# EAGLE design Gemma M0 rev D PyCon (EAGLE 6.4)
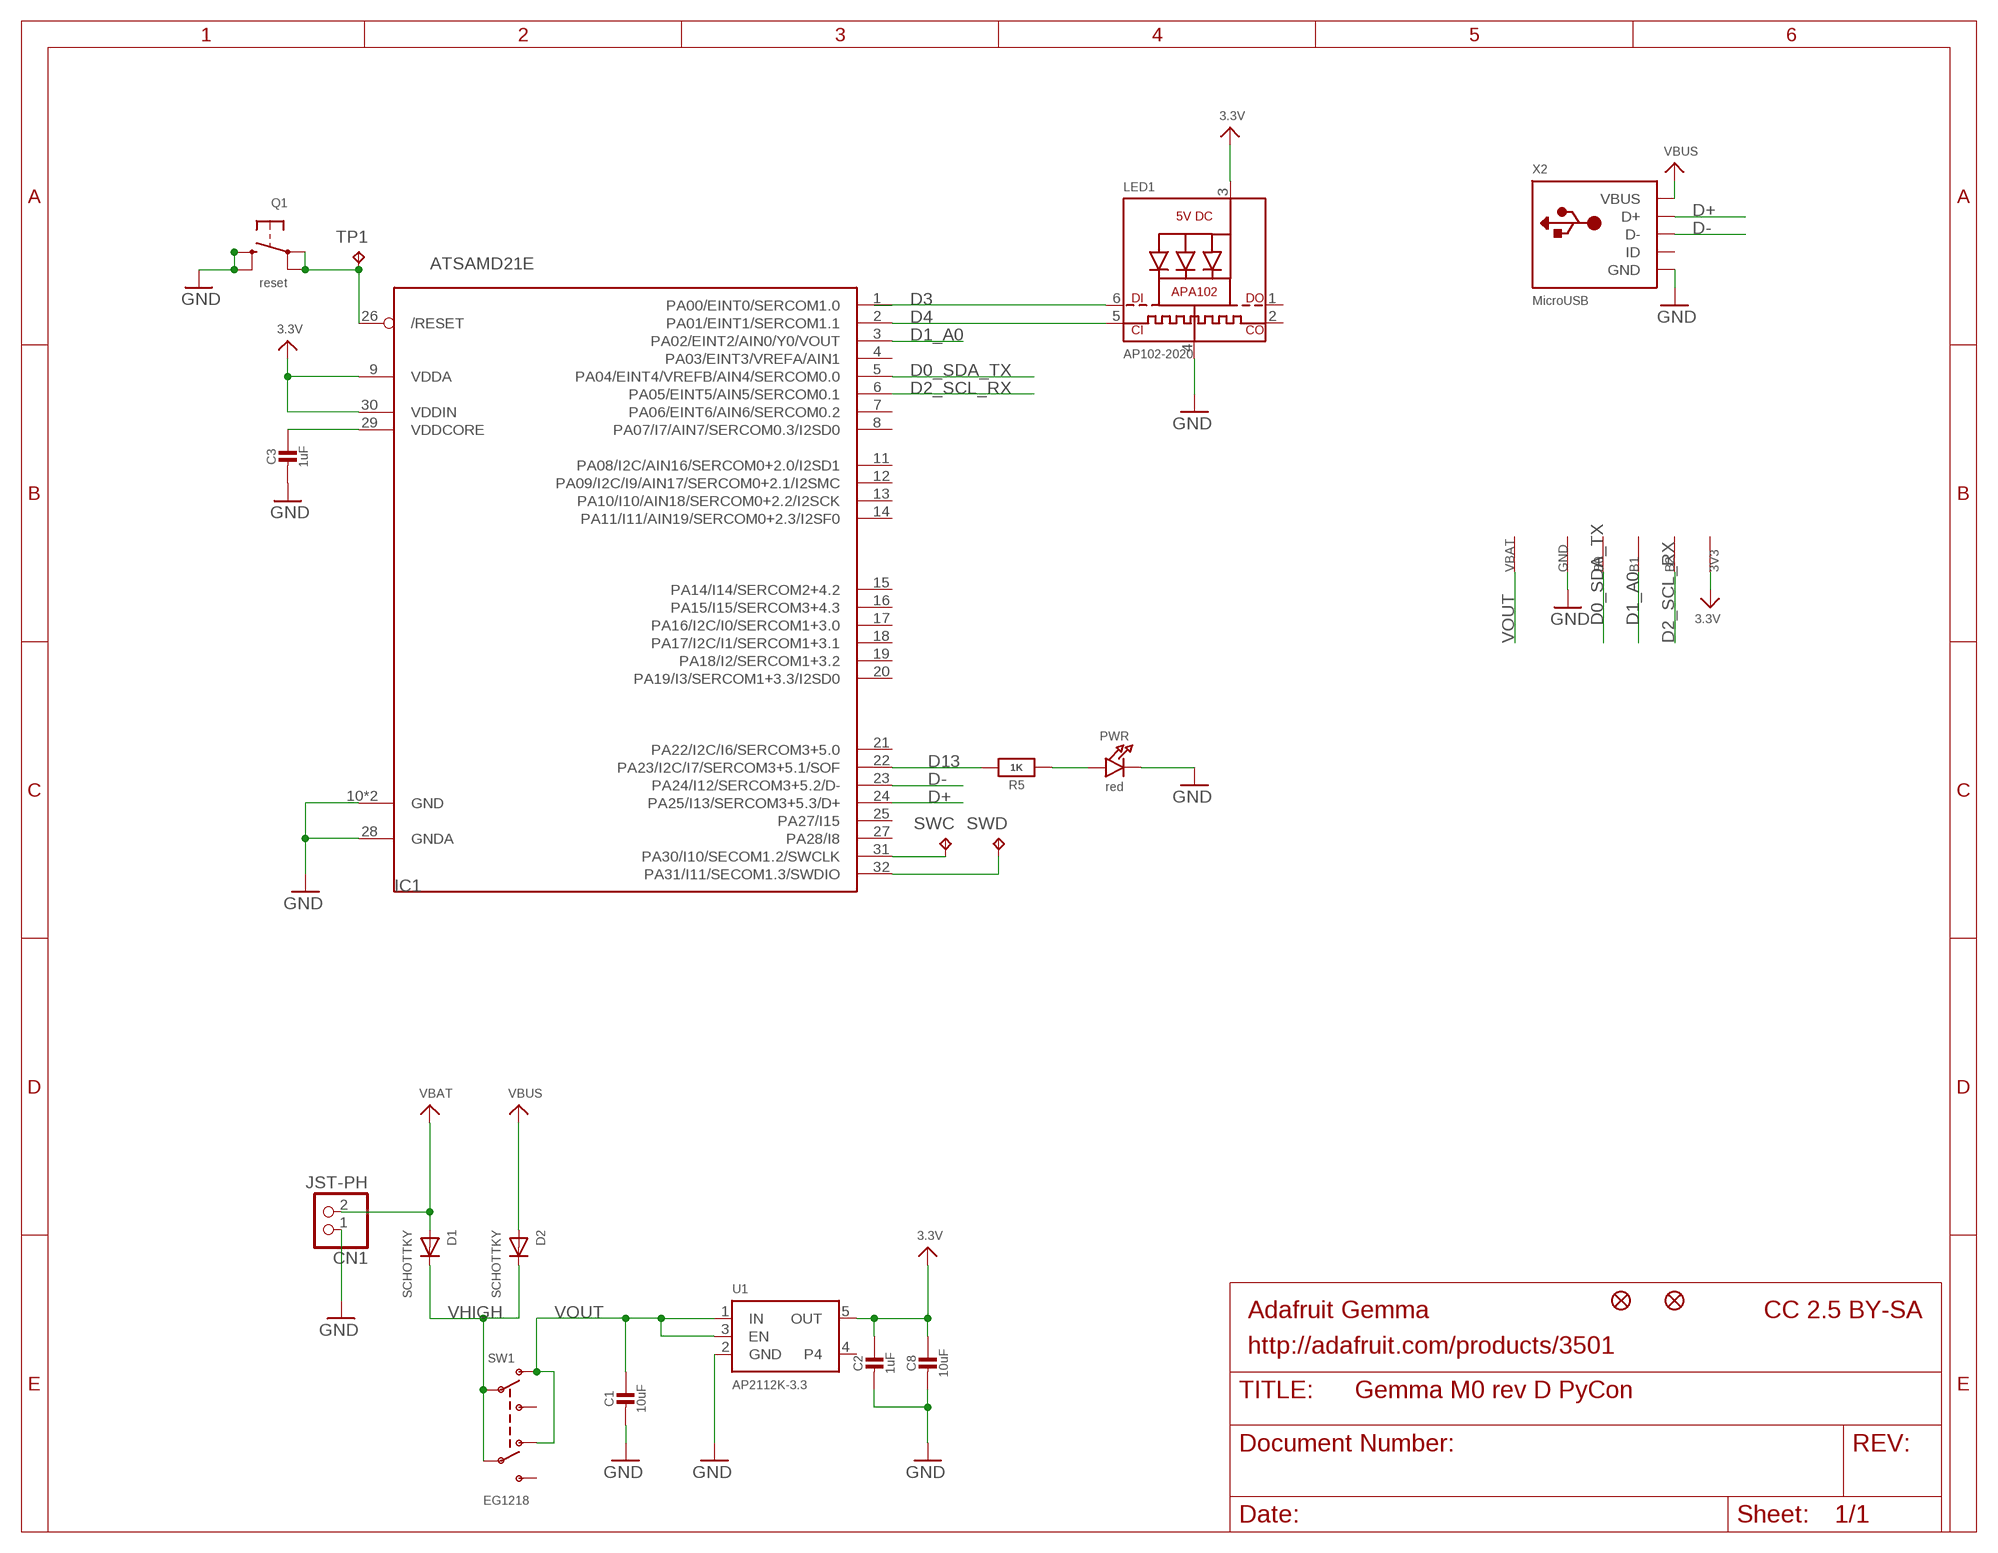
[diagram p0: schematic, sheet 1]

## Parts
3V3  SEWTAP-ALLIGATOR  [SEWALLI]
B0  SEWTAP-ALLIGATOR  [SEWALLI]
B1  SEWTAP-ALLIGATOR  [SEWALLI]
B2  SEWTAP-ALLIGATOR  [SEWALLI]
C1  10uF  CAP_CERAMIC0805-NOOUTLINE  [0805-NO]
C2  1uF  CAP_CERAMIC0603_NO  [0603-NO]
C3  1uF  CAP_CERAMIC0603_NO  [0603-NO]
C8  10uF  CAP_CERAMIC0805-NOOUTLINE  [0805-NO]
CN1  JST-PH  CON_JST_PH_2PIN  [JSTPH2]
D1  SCHOTTKY  DIODE_SOD-123FL  [SOD-123FL]
D2  SCHOTTKY  DIODE_SOD-123FL  [SOD-123FL]
GND  SEWTAP-ALLIGATOR  [SEWALLI]
IC1  ATSAMD21E  [QFN32_5MM]
LED1  AP102-2020  APA1022020  [APA102_2020]
PWR  red  LED0603_NOOUTLINE  [CHIPLED_0603_NOOUTLINE]
Q1  reset  SWITCH_TACT_SMT4.6X2.8  [BTN_KMR2_4.6X2.8]
R5  1K  RESISTOR_0603_NOOUT  [0603-NO]
SW1  EG1218  SWITCH_DPDTEG1390  [EG1390]
SWC  TPTP15R  [TP15R]
SWD  TPTP15R  [TP15R]
TP1  TPTP16R  [TP16R]
U1  AP2112K-3.3  VREG_SOT23-5  [SOT23-5]
U$1  FIDUCIAL_1MM  [FIDUCIAL_1MM]
U$6  FIDUCIAL_1MM  [FIDUCIAL_1MM]
VBAT  SEWTAP-ALLIGATOR  [SEWALLI]
X2  MicroUSB  USB_MICRO_20329_V2  [4UCONN_20329_V2]

## Nets
3.3V: 3V3.P$1(SEW) C2.1 C8.1 IC1.9(VDDA) IC1.30(VDDIN) LED1.3(VDD) U1.5(OUT)
!RESET: IC1.26(/RESET) Q1.A'(P1) Q1.A(P) TP1.TP
D0_SDA_TX: B0.P$1(SEW) IC1.5(PA04/EINT4/VREFB/AIN4/SERCOM0.0)
D1_A0: B1.P$1(SEW) IC1.3(PA02/EINT2/AIN0/Y0/VOUT)
D2_SCL_RX: B2.P$1(SEW) IC1.6(PA05/EINT5/AIN5/SERCOM0.1)
D3: IC1.1(PA00/EINT0/SERCOM1.0) LED1.6(DI)
D4: IC1.2(PA01/EINT1/SERCOM1.1) LED1.5(CKI)
D13: IC1.22(PA23/I2C/I7/SERCOM3+5.1/SOF) R5.2
D+: IC1.24(PA25/I13/SERCOM3+5.3/D+) X2.D+
D-: IC1.23(PA24/I12/SERCOM3+5.2/D-) X2.D-
GND: C1.2 C2.2 C3.2 C8.2 CN1.1 GND.P$1(SEW) IC1.10(GND) IC1.28(GNDA) IC1.33(GND) LED1.4(GND) PWR.C Q1.B'(S1) Q1.B(S) U1.2(GND) X2.BASE@1(GND) X2.BASE@2(GND) X2.GND X2.SPRT@1(GND) X2.SPRT@2(GND) X2.SPRT@3(GND) X2.SPRT@4(GND)
N$1: PWR.A R5.1
SWCLK: IC1.31(PA30/I10/SECOM1.2/SWCLK) SWC.TP
SWDIO: IC1.32(PA31/I11/SECOM1.3/SWDIO) SWD.TP
VBAT: CN1.2 D1.A
VBUS: D2.A X2.VBUS
VDDCORE: C3.1 IC1.29(VDDCORE)
VHIGH: D1.C D2.C SW1.P1 SW1.P2
VOUT: C1.1 SW1.O1 SW1.O2 U1.1(IN) U1.3(EN) VBAT.P$1(SEW)
Unconnected: IC1.4(PA03/EINT3/VREFA/AIN1) IC1.7(PA06/EINT6/AIN6/SERCOM0.2) IC1.8(PA07/I7/AIN7/SERCOM0.3/I2SD0) IC1.11(PA08/I2C/AIN16/SERCOM0+2.0/I2SD1) IC1.12(PA09/I2C/I9/AIN17/SERCOM0+2.1/I2SMC) IC1.13(PA10/I10/AIN18/SERCOM0+2.2/I2SCK) IC1.14(PA11/I11/AIN19/SERCOM0+2.3/I2SF0) IC1.15(PA14/I14/SERCOM2+4.2) IC1.16(PA15/I15/SERCOM3+4.3) IC1.17(PA16/I2C/I0/SERCOM1+3.0) IC1.18(PA17/I2C/I1/SERCOM1+3.1) IC1.19(PA18/I2/SERCOM1+3.2) IC1.20(PA19/I3/SERCOM1+3.3/I2SD0) IC1.21(PA22/I2C/I6/SERCOM3+5.0) IC1.25(PA27/I15) IC1.27(PA28/I8) LED1.1(DO) LED1.2(CKO) SW1.S1 SW1.S2 U1.4 X2.ID

## Notes on the sheet
- Adafruit Gemma | CC 2.5 BY-SA
- http://adafruit.com/products/3501

## Library data of the parts
3V3 B0 B1 B2 GND VBAT = microbuilder:SEWTAP
C1-C3 C8 = microbuilder:CAP_CERAMIC: Ceramic Capacitors For new designs, use the packages preceded by an '_' character since they are more reliable: The following footprints should be used on most boards: _0402 - Standard footprint for regular board layouts _0603 - Standard footprint for regular board layouts _0805 - Standard footprint for regular board layouts _1206 - Standard footprint for regular board layouts For extremely tight-pitch boards where space is at a premium, the following 'micro-pitch' footprints can be used (smaller pads, no silkscreen outline, etc.): _0402MP - Micro-pitch footprint for very dense/compact boards _0603MP - Micro-pitch footprint for very dense/compact boards _0805MP - Micro-pitch footprint for very dense/compact boards _1206MP - Micro-pitch footprint for very dense/compact boards
CN1 = microbuilder:CON_JST_PH_2PIN: JST 2-Pin Right-Angle Connector PH-Series - 4UConnector: 17311 SH-Series - 4UConnector: 07278
D1 D2 = adafruit:DIODE: Diode SMADIODE - SMA Surface Mount Package 20V 1A Schottky Diode Digikey: 641-1014-6-ND DO-1N4148 - Through Hole Small Current Diode SOD-123 20V 1 A (.5mV Vf) Schottky Diode - Digikey: MBRX120TPMSCT-ND SOD-323 10V 570mA (.38mV Vf, 3ns) Schottky Diode - Digikey: ZLLS410CT-ND SOD-523 30V 30mA Schottky Diode (RB751S-40TE61) - Digikey: RB751S-40TE61CT-ND SOT23-R/W - SOT23 Package (R = Solder Paste/Reflow Ovens, W = Hand-Soldering) BAT54Film 40V 300mA - Digikey: 497-7162-1-ND
IC1 = microbuilder:ATSAMD21E
LED1 = microbuilder:APA102: APA102/DotStar Pixels VCC: 5V DC Refresh Rate: 400Hz
PWR = microbuilder:LED: LED 0603 - 0603 Surface Mount Package 2mA: Green LED - Low Power (3.9mcd, 2ma, 1.7Vf) - Digikey: 475-2709-2-ND Orange LED - Low Power (9.8mcd, 2ma, 1.8Vf) - Digikey: 475-1194-2-ND Red LED - Low Power (5mcd, 2ma, 1.8Vf) - Digikey: 475-1195-2-ND Yellow LED - Low Power (7mcd, 2ma, 1.8Vf) - Digikey: 475-1196-2-ND 5mA: Blue LED - Low Power (17mcd, 5ma, 2.9Vf) - Digikey: LNJ937W8CRACT-ND 0805 - 0805 Surface Mount Package 2mA: Red LED (8.8mcd, 2mA, 1.8Vf, Clear) - Low Power [Digikey: 475-2510-1-ND] Green LED (5mcd, 2mA, 1.8Vf, Clear) - Low Power [Digikey: 475-2730-1-ND] Yellow LED (11.3mcd, 2mA, 1.8Vf, Clear) - Low Power [Digikey: 475-2555-1-ND] 20mA: Red LED (104mcd, 20mA, Diffused) - LS R976 [Digikey: 475-1278-6-ND] Red LED (12mcd, 20mA, 2.0Vf, Clear) - APT2012EC [Digikey: 754-1128-1-ND] Green LED (15mcd, 20mA, 2.2Vf, Clear) - APT2012GC [Digikey: 754-1131-1-ND] Orange LED (160mcd, 20mA, 2.1Vf, Clear) - APT2012SECK [Digikey: 754-1130-1-ND] 1206 - 1206 Surface Mount Package Green LED (26mcd, 20mA, Diffused) - LG N971 [Digikey: 475-1407-6-ND] Red LED (15mcd, 20mA, Diffused) - LH N974 [Digikey: 475-1416-6-ND] Cree - Cree High-Power Surface Mount LEDs XPEBWT-L1-0000-00D50 - White 111lm 350mA 2.9Vf 6200K 110° XTEAWT-00-0000-00000LEE3 - White 114lm 350mA 2.85Vf 5000K 115° Everlight - Everlight 45-21 Series Surface Mount LEDs 45-21/QK2C-B2832AC2CB2/2T - Warm White 2000mcd 20mA 3.25Vf 3050K 120° 45-21/LK2C-B38452C4CB2/2T - Nuetral White 2000mcd 20mA 3.25Vf 4150K 120° 45-21/LK2C-B50634C6CB2/2T - Cold White 2200mcd 20mA 3.25Vf 5650K 120° PLCC2 Reverse Mount LS T77K-J1L2-1-0-2-R18-Z - Red 11.25mcd 2mA 1.8Vf 630nm 120° LO T77K-L1M2-24-Z - Orange 19.6mcd 2mA 1.8Vf 606nm 120° LY T77K-K2M1-26-Z - Yellow 15.7mcd 2mA 1.8Vf 587nm 120°
Q1 = microbuilder:SWITCH_TACT_SMT: SMT Tact Switches 6x6mm - Digikey: P12940SCT-ND KMR2 (4.6x2.8mm) - Digikey: 401-1426-1-ND EVQ-PQHB55 - Light Touch, 160GF (4.5x4.5mm) - Digikey: P8090SCT-ND KMT0 - KMT021 NGJ LHS (etc.) IP68/Waterproof - Digikey: CKN10289CT-ND
R5 = microbuilder:RESISTOR: Resistors For new designs, use the packages preceded by an '_' character since they are more reliable: The following footprints should be used on most boards: _0402 - Standard footprint for regular board layouts _0603 - Standard footprint for regular board layouts _0805 - Standard footprint for regular board layouts _1206 - Standard footprint for regular board layouts For extremely tight-pitch boards where space is at a premium, the following 'micro-pitch' footprints can be used (smaller pads, no silkscreen outline, etc.): _0402MP - Micro-pitch footprint for very dense/compact boards _0603MP - Micro-pitch footprint for very dense/compact boards _0805MP - Micro-pitch footprint for very dense/compact boards _1206MP - Micro-pitch footprint for very dense/compact boards
SW1 = microbuilder:SWITCH_DPDT: Switch - DPDT A DPDT Switch acts like an SPDT switch, but has a pair of switches instead of just one. Vertical - 0.3A @ 6V SMT - Digikey: JS202011SCQN
SWC SWD TP1 = testpad:TP: Test pad
U1 = microbuilder:VREG_SOT23-5: SOT23-5 Fixed Voltage Regulators Part Current Out V Out V In V Dropout θJA (°C/W) TJ (°C) Digikey Part No. ADP121 150mA 3.3V 3.4-5.5V 0.09V @ 150mA -- -- ADP121-AUJZ33R7CT-ND ADP121 150mA 3.0V 3.1-5.5V 0.09V @ 150mA -- -- ADP121-AUJZ30R7CT-ND ADP122 300mA 3.3V 3.4-5.5V 0.085V @ 300mA -- -- ADP122AUJZ-3.3-R7CT-ND ADP1712 300mA 3.3V 3.5-5.5V 0.17V @ 300mA -- -- ADP1712AUJZ-3.3-R7TR-ND AP7311 (Low Cost) 150mA 3.3V 3.5-6V 0.15V @ 150mA -- -- AP7311-33WG-7DICT-ND LD39015M18R 150mA 1.8V 1.9V-5.5V 0.08V @ 100mA -- -- 497-6977-1-ND LP2985A-33DBVR 150mA 3.3V 3.3-16V 0.28V @ 150mA 206 150 296-18479-1-ND MCP1824T-3302E/OT 300mA 3.3V 3.5V-6V 0.2V @ 300mA -- -- MCP1824T-3302E/OTCT-ND MIC5205-2.5YM5 TR 150mA 2.5V 2.7-16V 0.165V @ 150mA -- -- 576-1257-2-ND MIC5205-3.0YM5 TR 150mA 3.0V 3.2V-16V 0.165V @ 150mA -- -- 576-1258-2-ND MIC5205-3.3YM5 TR 150mA 3.3V 3.5V-16V 0.165V @ 150mA -- -- 576-1259-2-ND TPS780330220 150mA 3.3V+2.2V 3.6-5.5V 250mV Max -- -- 296-23332-1-ND TDA3663/N1,135 100mA 3.3V 3.5-45V 0.18V @ 50mA -- -- 568-5343-1-ND Max operating temp can be calculated using θJA, TJ (max junction temperature), and power in watts. Set the "Maximum Ambient Temperature" until it reaches TJ ("Max Junction Temperature"), which is the absolute limit for safe use of the regulator: Heat Sink Temperature Calculator <http://www.daycounter.com/Calculators/Heat-Sink-Temperature-Calculator.phtml> For example, With 12V source into a 3.3V LP2985 and a 30mA load, we are dissipating (12V-3.3V) * 0.03A = 0.261W. With a θJA of 206 °C/W, a TJ of 150°C, and 261mW we can safely use the chip without a heat sink up to 75°C (=147.1°C Junction Temperature).
U$1 U$6 = microbuilder:FIDUCIAL: Fiducial Alignment Points Various fiducial points for machine vision alignment.; BOM: EXCLUDE
X2 = microbuilder:USB: USB Connectors USBMINIB - Surface Mount Female Mini-B USB Connector 4UConnector: 06564

## Board
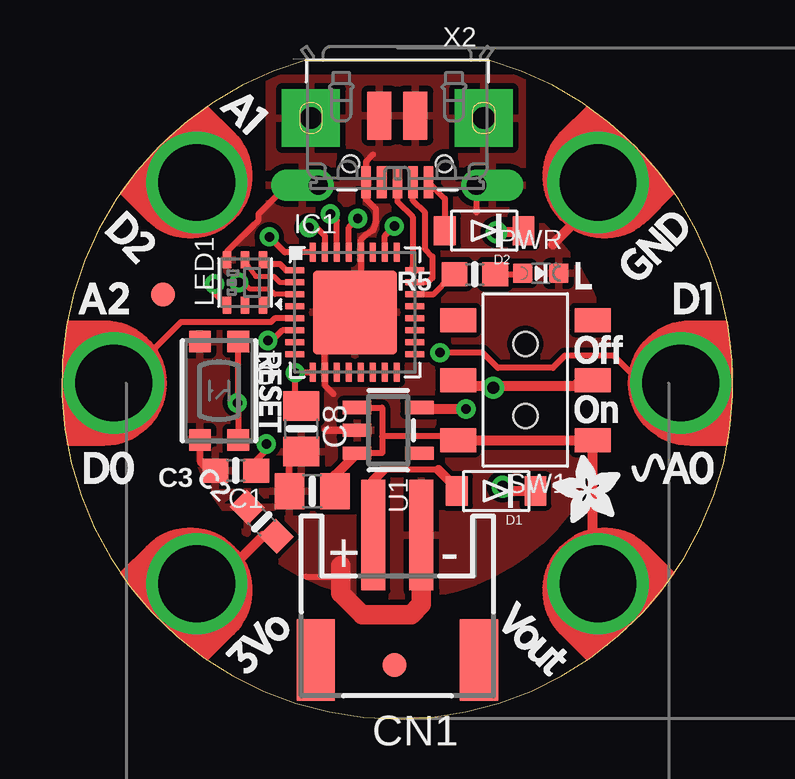
[diagram p1: board, top side]
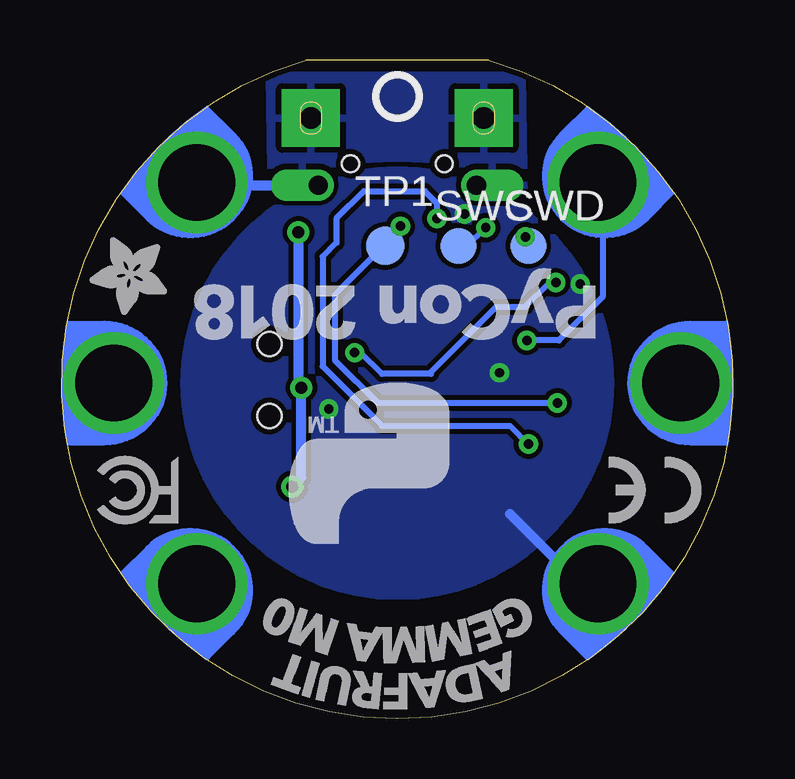
[diagram p2: board, bottom side, seen from below]

Size 27.97 x 27.46 mm. Coordinates in mm from the lower left corner, seen from the top.
Outline: 10.17,27.46 17.79,27.46 arc-328 10.17,27.46
Copper layers (1*16): Top 0.035mm / dielectric 1.5mm / Bottom 0.035mm
Design rules "adafruit *": minimum track width 8mil, minimum drill 15.5mil, track to track 8mil, track to pad 8mil, pad to pad 8mil, via to via 8mil, smd to smd 8mil, copper to edge 10mil, drill to drill 8mil, minimum pad ring 10mil, minimum via ring 8mil, stop-mask expansion 2mil, vias tented up to drill 20mil, thermal gap 10mil

### Footprints (pad centres in the part's own frame; a part is rotated, then mirrored left to right if it is on the bottom)
SEWALLI = drill 3.2: P$1 0,0.508
0805-NO = smd 1.24 x 1.5: 1 -0.95,0; 2 0.95,0
0603-NO = smd 1.075 x 1: 1 -0.85,0; 2 0.85,0
JSTPH2 = smd 1 x 4.6: 1 -1,-3.7; 2 1,-3.7 | smd 1.6 x 3.4: NC1 -3.4,1.5; NC2 3.4,1.5
SOD-123FL = smd 0.91 x 1.22: A 1.637,0; C -1.637,0
QFN32_5MM = smd 0.8 x 0.25: 1 -2.5,1.75; 2 -2.5,1.25; 3 -2.5,0.75; 4 -2.5,0.25; 5 -2.5,-0.25; 6 -2.5,-0.75; 7 -2.5,-1.25; 8 -2.5,-1.75; 17 2.5,-1.75; 18 2.5,-1.25; 19 2.5,-0.75; 20 2.5,-0.25; 21 2.5,0.25; 22 2.5,0.75; 23 2.5,1.25; 24 2.5,1.75 | smd 0.25 x 0.8: 9 -1.75,-2.5; 10 -1.25,-2.5; 11 -0.75,-2.5; 12 -0.25,-2.5; 13 0.25,-2.5; 14 0.75,-2.5; 15 1.25,-2.5; 16 1.75,-2.5; 25 1.75,2.5; 26 1.25,2.5; 27 0.75,2.5; 28 0.25,2.5; 29 -0.25,2.5; 30 -0.75,2.5; 31 -1.25,2.5; 32 -1.75,2.5 | smd 3.5 x 3.5: 33 0,0
APA102_2020 = smd 0.7 x 0.35: 1 -0.95,-0.75; 2 -0.95,0; 3 -0.95,0.75; 4 0.95,0.75; 5 0.95,0; 6 0.95,-0.75
CHIPLED_0603_NOOUTLINE = smd 0.8 x 0.8: A 0,-0.75; C 0,0.75
BTN_KMR2_4.6X2.8 = smd 0.9 x 0.9: A 2.05,0.8; A' -2.05,0.8; B 2.05,-0.8; B' -2.05,-0.8
EG1390 = smd 1 x 1.5: O1 -2.5,2.8; O2 -2.5,-2.8; P1 0,2.8; P2 0,-2.8; S1 2.5,2.8; S2 2.5,-2.8 | hole 1: 1.5,0; -1.5,0
TP15R = smd 1.5 x 1.5: TP 0,0
TP16R = smd 1.6 x 1.6: TP 0,0
SOT23-5 = smd 0.55 x 1.2: 1 -0.95,-1.3; 2 0,-1.3; 3 0.95,-1.3; 4 0.95,1.3; 5 -0.95,1.3
FIDUCIAL_1MM = smd 1 x 1: 1 0,0
4UCONN_20329_V2 = smd 1 x 2: BASE@1 -0.75,-2; BASE@2 0.75,-2 | smd 0.4 x 1.35: D+ 0,0.775; D- -0.65,0.775; GND 1.3,0.775; ID 0.65,0.775; VBUS -1.3,0.775 | drill 0.8 pad 1.143 offset: SPRT@1 -3.3,0.9; SPRT@2 3.3,0.9 | drill 0.9 pad 2.413 square: SPRT@3 -3.6,-1.9; SPRT@4 3.6,-1.9 | hole 0.7: -1.95,0; 1.95,0

### Placement (x,y rotation side)
3V3  5.98,5.99 135 top
B0  2.68,14 90 top
B1  25.29,14 270 top
B2  5.98,22 45 top
C1  10.44,9.49 180 top
C2  8.33,8.22 135 top
C3  7.26,10.35 180 top
C8  9.98,12.09 270 top
CN1  13.98,3.96 180 top
D1  18.1,9.5 180 top
D2  17.6,20.35 180 top
GND  21.99,22 315 top
IC1  12.21,16.94 0 top
LED1  7.63,18.19 90 top
PWR  19.95,18.57 270 top
Q1  6.55,13.68 270 top
R5  17.21,18.53 180 top
SW1  19.32,14.12 90 top
SWC  11.44,19.71 0 bottom
SWD  8.52,19.71 0 bottom
TP1  14.49,19.71 0 bottom
U1  13.6,12.03 270 top
U$1  4.22,17.68 90 top
U$2  [GEMMA_M0_PYCON_BOTTOM]  0.01,27.33 180 bottom
U$6  13.86,2.24 0 top
U$8  [GEMMA_M0_TOP]  0.01,0.03 0 top
U$10  [PCBFEAT-REV-040]  13.98,25.93 0 bottom
VBAT  21.99,5.99 225 top
X2  13.98,23.14 180 top

### Tracks (layer width: path | path; a pad name or v marks a point on that pad's centre or on a via)
3.3V  (via drill 0.39)
  Top 0.254: IC1.30 11.46,20.77 v11.19,21.04 | IC1.9 10.45,14.43 v9.73,14.43 | LED1.3 6.36,17.76 v6.36,18.12 | 9.79,14.36 v9.73,14.43 | C8.1 9.73,13.29 v9.73,14.43
  Top 0.406: C2.1 8.37,7.62 6.39,5.64 3V3.P$1 | U1.5 14.96,12.92 v16.84,12.92
  Bottom 0.254: 3V3.P$1 6.39,5.64
  Bottom 0.406: 6.39,5.64 9.29,8.53
  pour Bottom: 5.09,14 arc90 13.98,5.11 arc90 22.87,14 arc90 13.98,22.89 arc90
!RESET  (via drill 0.39)
  Top 0.254: IC1.26 13.46,20.14 v13.86,20.54 | 7.35,15.56 Q1.A' 7.35,13.21 v7.32,13.17 7.35,13.13 Q1.A
  Bottom 0.254: 14.49,19.77 14.43,19.84 14.43,19.96 v13.86,20.54 | 14.49,19.77 16.59,17.68 16.59,14.95 14.81,13.17 v7.32,13.17 | TP1.TP 14.49,19.77
D0_SDA_TX
  Top 0.254: IC1.5 8.87,16.69 8.71,16.54 4.97,16.54 2.43,14 B0.P$1
D1_A0  (via drill 0.39)
  Top 0.203: IC1.3 8.89,17.69 8.65,17.93 7.82,17.93 7.57,18.19 v7.38,18.19
  Top 0.254: B1.P$1 24.14,14 23,15.14 20.97,15.14 20.46,14.63 18.18,14.63 17.54,15.27 v15.76,15.27
  Bottom 0.254: v15.76,15.27 15.51,15.27 14.62,14.38 12.59,14.38 12.59,14.44 9.86,17.17 8.65,17.17 7.63,18.19 v7.38,18.19
D2_SCL_RX  (via drill 0.39)
  Top 0.254: IC1.6 9.2,16.19 8.78,15.77 v8.59,15.77
  Bottom 0.254: 5.6,22.33 B2.P$1 | 5.67,22.31 B2.P$1 | v8.59,15.77 7.25,15.77 5.41,17.61 5.41,20.22 5.62,20.43 B2.P$1
D3
  Top 0.203: 9.67,18.69 IC1.1
  Top 0.254: 9.67,18.69 9.35,18.69 9.1,18.95 8.57,18.95 LED1.6
D4
  Top 0.203: IC1.2 9.09,18.19 8.84,18.44 8.08,18.44 7.76,18.88 7.63,19.01 LED1.5
D13
  Top 0.254: IC1.22 15.47,17.69 16.22,18.44 16.27,18.44 R5.2
D+
  Top 0.254: X2.D+ 13.98,21.55 14.62,20.92 14.62,18.85 14.71,18.76 IC1.24
D-
  Top 0.254: IC1.23 15.26,18.19 15.44,18.38 15.44,19.27 15.13,19.58 15.13,21.11 14.63,21.6 X2.D-
GND
  Top 0.254: 17.28,21.09 X2.SPRT@1 17.4,22.36 | 10.68,22.12 X2.SPRT@2 9.4,22.24 8.21,21.04 8.21,20.79 6.88,19.47 LED1.4 | 12.21,17.01 10.96,15.76 IC1.10 10.96,13.91 11.32,13.55 | 10.17,5.93 11.64,5.93 | Q1.B 5.76,10.7 6.1,10.35 C3.2 | 12.97,23.52 12.68,23.24 X2.GND 12.68,21.65 13.1,21.23 13.1,20.79 12.97,20.35 12.65,20.16 12.46,19.97 IC1.28 12.46,17.26 12.21,17.01 | 12.21,17.01 IC1.33 | C1.2 9.49,10.9 9.73,11.14 C8.2
  Top 0.305: 11,12.03 U1.2
  Top 0.406: 20.46,19.77 22.34,21.66 GND.P$1
  Top 0.813: CN1.1 14.98,4.77 14.56,4.34 12.52,4.34 11.64,5.23 11.64,5.93 11.64,6.38
  Bottom 0.406: 22.34,22.01 22.11,22.24 | 22.11,22.24 X2.SPRT@1 | GND.P$1 22.23,22.24 22.11,22.24
  pour Bottom (rank 2): 8.78,26.82 8.65,18.95 19.19,18.95 19.32,26.82
  pour Top: 5.09,14 arc90 13.98,5.11 arc90 22.87,14 arc90 13.98,22.89 arc90
  pour Top: 8.65,26.7 8.65,18.95 19.19,18.95 19.19,26.7
N$1
  Top 0.254: R5.1 19.17,18.53 PWR.A
SWCLK  (via drill 0.39)
  Top 0.254: IC1.31 10.96,20.13 10.62,20.47 v10.3,20.47
  Bottom 0.254: SWC.TP 11.06,19.71 v10.3,20.47
SWDIO  (via drill 0.39)
  Top 0.254: IC1.32 9.3,19.44 v8.65,20.09
  Bottom 0.254: SWD.TP 8.52,19.96 v8.65,20.09
VBAT
  Top 0.254: D1.A 16.47,9.74 | 15.7,10.38 13.41,10.38 | 12.97,7.68 CN1.2
  Top 0.406: 15.7,10.38 16.47,9.61 D1.A | 13.41,10.38 12.98,9.95 CN1.2
VBUS
  Top 0.254: X2.VBUS 15.97,21.68 D2.A
VDDCORE  (via drill 0.39)
  Top 0.254: IC1.29 11.96,20.48 v12.33,20.85 | v8.52,11.46 8.52,11.2 8.11,10.78 C3.1
  Bottom 0.254: v8.52,11.46 9.29,12.22 14.62,12.22 17.1,14.69 17.1,19.27 16.52,19.84 16.52,20.85 15.38,22 12.84,22 12.33,21.49 v12.33,20.85
VHIGH  (via drill 0.5)
  Top 0.406: D1.C 18.55,9.5 v18.37,9.68 | v17.98,13.8 18.05,13.87 | SW1.P2 21.6,14.12 21.35,13.87 18.05,13.87 | 18.05,13.87 16.77,13.87 SW1.P1 | D2.C 19.18,20.28 v18.11,20.28
  Bottom 0.406: v18.11,20.28 18.11,13.93 v17.98,13.8 17.98,10.06 v18.37,9.68
VOUT
  Top 0.254: U1.1 13.35,12.98 13.35,11.77 | 13.35,11.77 13.35,11.07 U1.3 | SW1.O1 16.37,11.77 13.35,11.77
  Top 0.406: SW1.O1 SW1.O2 22.12,5.86 VBAT.P$1 | C1.1 11.39,10.16 U1.3

### Text on the board
tPlace: + | -
tDocu: SCL/SCK | GND | SDA/MOSI | MISO | 3-16VDC